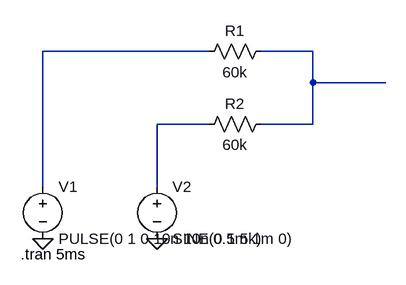
[diagram p0: schematic Draft2.asc]
Draft2.asc, the LTspice schematic file:
Version 4
SHEET 1 880 680
WIRE 336 0 80 0
WIRE 496 0 416 0
WIRE 496 48 496 0
WIRE 608 48 496 48
WIRE 336 112 256 112
WIRE 496 112 496 48
WIRE 496 112 416 112
WIRE 80 208 80 0
WIRE 256 208 256 112
FLAG 80 288 0
FLAG 256 288 0
SYMBOL voltage 80 192 R0
WINDOW 123 0 0 Left 0
WINDOW 39 0 0 Left 0
SYMATTR InstName V1
SYMATTR Value PULSE(0 1 0 10n 10n 0.5m 1m 0)
SYMBOL voltage 256 192 R0
WINDOW 123 0 0 Left 0
WINDOW 39 0 0 Left 0
SYMATTR InstName V2
SYMATTR Value SINE(0 1 5k)
SYMBOL res 432 -16 R90
WINDOW 0 0 56 VBottom 2
WINDOW 3 32 56 VTop 2
SYMATTR InstName R1
SYMATTR Value 60k
SYMBOL res 432 96 R90
WINDOW 0 0 56 VBottom 2
WINDOW 3 32 56 VTop 2
SYMATTR InstName R2
SYMATTR Value 60k
TEXT 46 312 Left 2 !.tran 5ms

The netlist it stands for:
* Draft2.asc
V1 N001 0 PULSE(0 1 0 10n 10n 0.5m 1m 0)
V2 N003 0 SINE(0 1 5k)
R1 N002 N001 60k
R2 N002 N003 60k
.tran 5ms
.backanno
.end